# EAGLE design microBackpack (EAGLE 9.4.2)

## Sheet 1 of 2
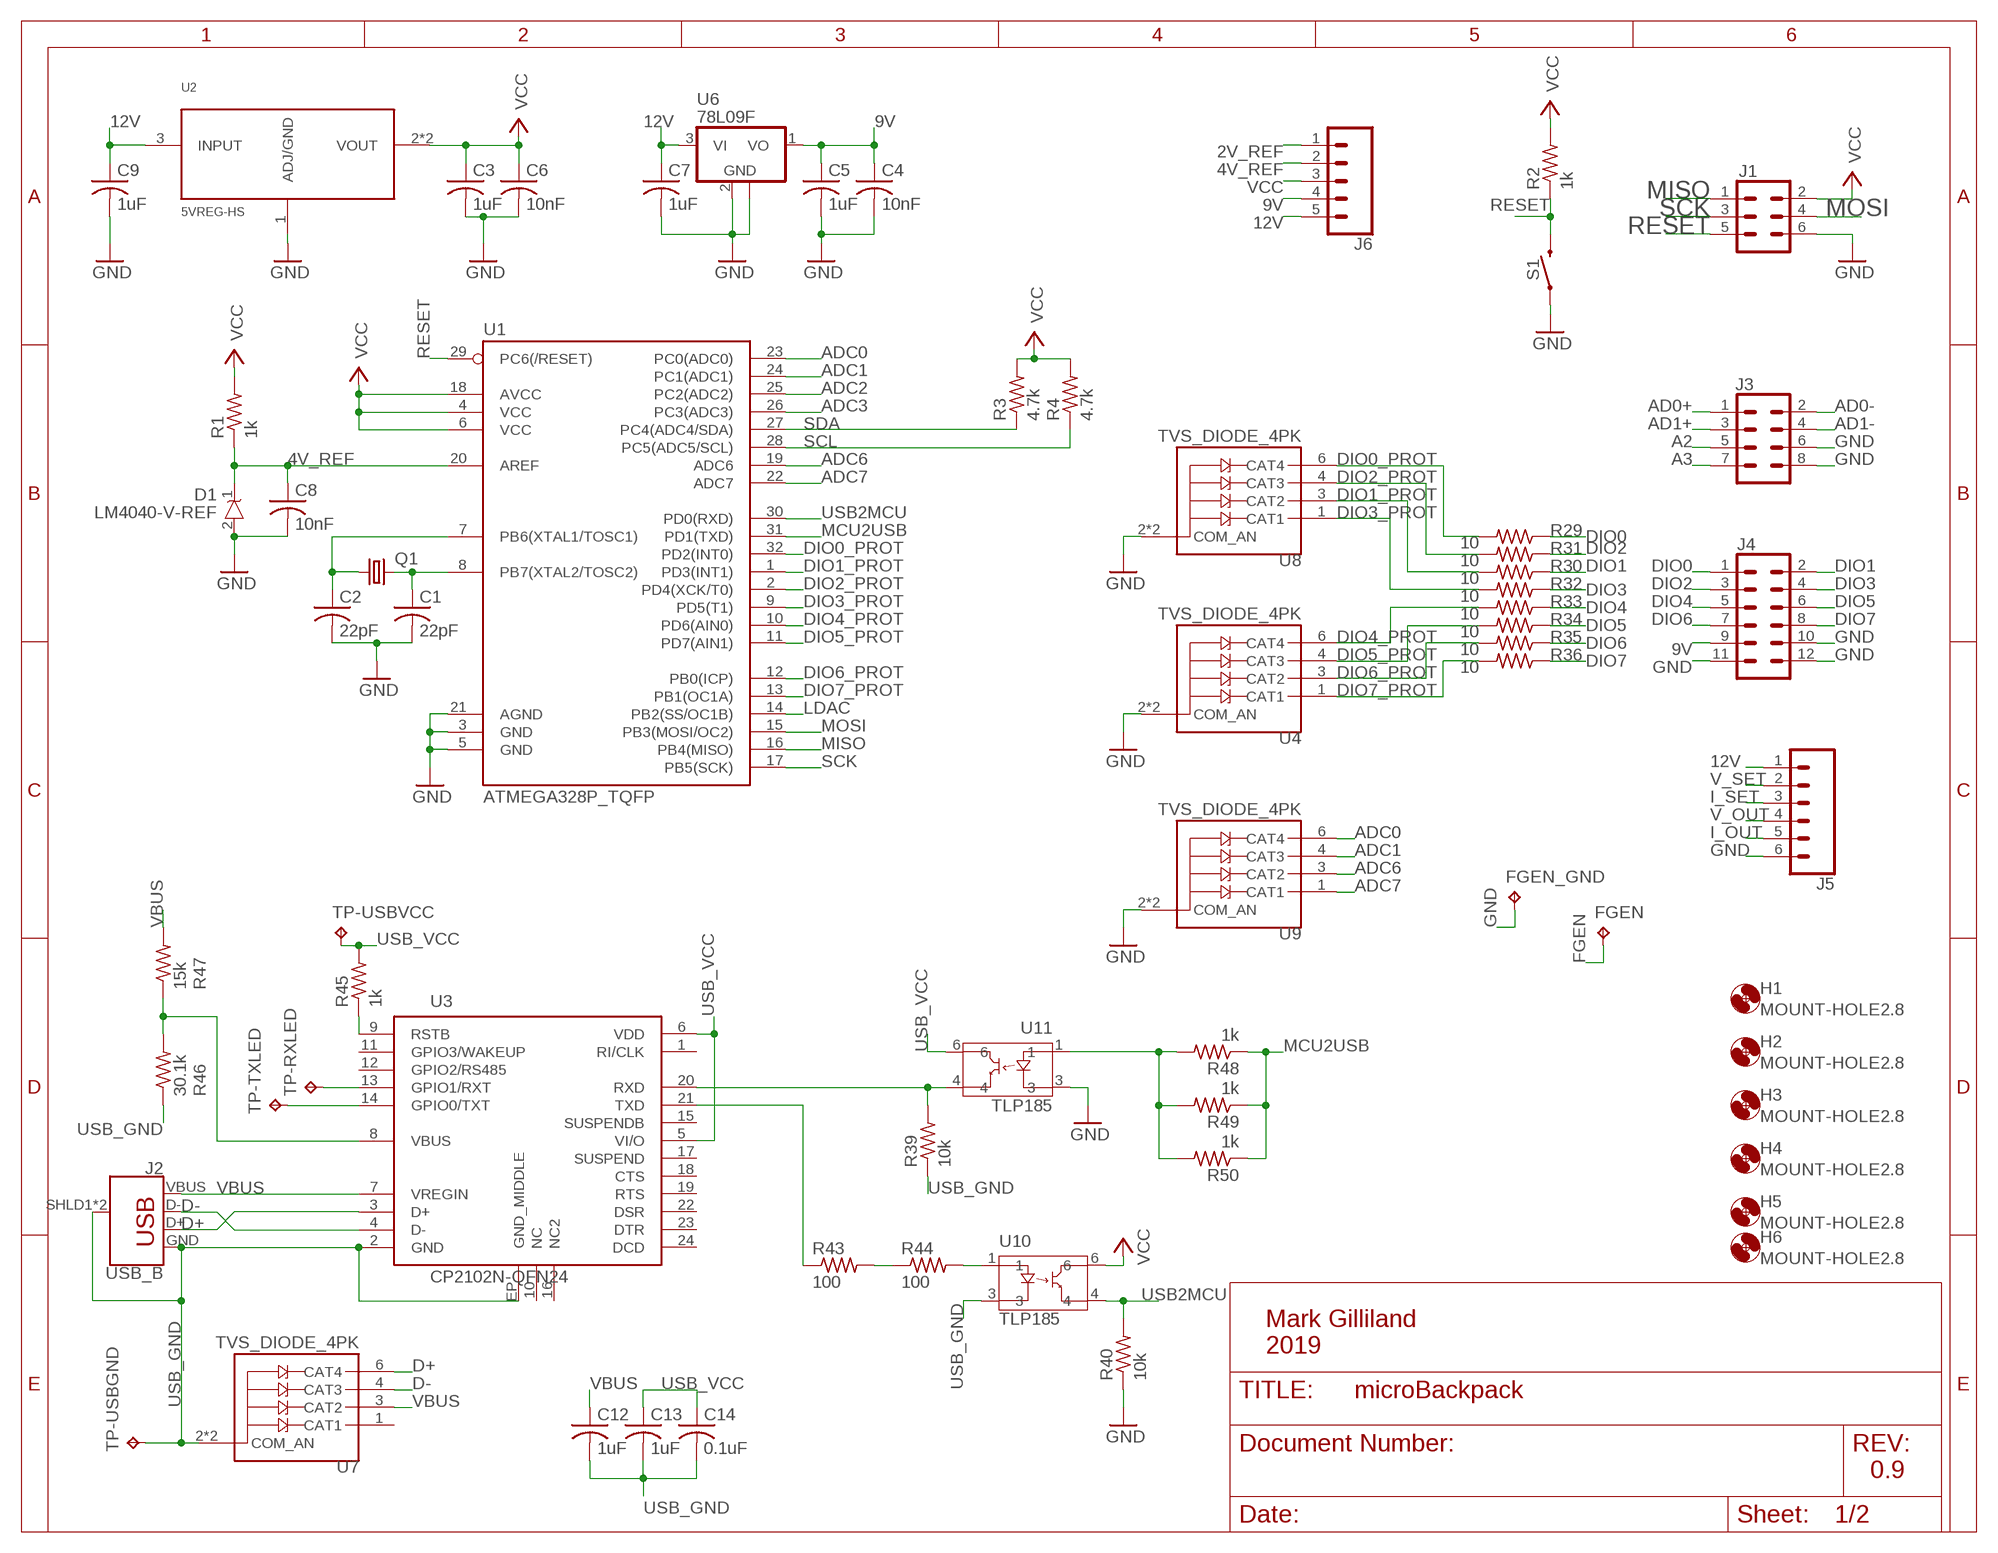
[diagram p0: schematic, sheet 1]

### Parts
C1  22pF  C-USC0805  [C0805]
C2  22pF  C-USC0805  [C0805]
C3  1uF  C-USC0805  [C0805]
C4  10nF  C-USC0805  [C0805]
C5  1uF  C-USC0805  [C0805]
C6  10nF  C-USC0805  [C0805]
C7  1uF  C-USC0805  [C0805]
C8  10nF  C-USC0805  [C0805]
C9  1uF  C-USC0805  [C0805]
C12  1uF  C-USC0805  [C0805]
C13  1uF  C-USC0805  [C0805]
C14  0.1uF  C-USC0805  [C0805]
D1  LM4040-V-REF  [SOT23]
FGEN  TPPAD1-20Y  [P1-20Y]
FGEN_GND  TPPAD1-20Y  [P1-20Y]
H1  MOUNT-HOLE2.8  [2,8]
H2  MOUNT-HOLE2.8  [2,8]
H3  MOUNT-HOLE2.8  [2,8]
H4  MOUNT-HOLE2.8  [2,8]
H5  MOUNT-HOLE2.8  [2,8]
H6  MOUNT-HOLE2.8  [2,8]
J1  CONN_03X22X3_SILK_MALE_PTH  [2X3]
J2  USB_B  [USB-B-PTH-VERT]
J3  CONN_04X2  [2X4]
J4  2X6 FEMALE  CONN_06X2PTH_FEMALE  [2X6]
J5  CONN_06SILK_FEMALE_PTH  [1X06]
J6  CONN_05NO_SILK  [1X05_NO_SILK]
Q1  CRYSTALHC49U70  [HC49U70]
R1  1k  R-US_R0805  [R0805]
R2  1k  R-US_R0805  [R0805]
R3  4.7k  R-US_R0805  [R0805]
R4  4.7k  R-US_R0805  [R0805]
R29  10  R-US_R0805  [R0805]
R30  10  R-US_R0805  [R0805]
R31  10  R-US_R0805  [R0805]
R32  10  R-US_R0805  [R0805]
R33  10  R-US_R0805  [R0805]
R34  10  R-US_R0805  [R0805]
R35  10  R-US_R0805  [R0805]
R36  10  R-US_R0805  [R0805]
R39  10k  R-US_R0805  [R0805]
R40  10k  R-US_R0805  [R0805]
R43  100  R-US_R0603  [R0603]
R44  100  R-US_R0603  [R0603]
R45  1k  R-US_R0805  [R0805]
R46  30.1k  R-US_R0805  [R0805]
R47  15k  R-US_R0805  [R0805]
R48  1k  R-US_R0805  [R0805]
R49  1k  R-US_R0805  [R0805]
R50  1k  R-US_R0805  [R0805]
S1  MOMENTARY-SWITCH-SPST-SMD-5.2-REDUNDANT  [TACTILE_SWITCH_SMD_5.2MM]
TP-RXLED  TPPAD1-13  [P1-13]
TP-TXLED  TPPAD1-13  [P1-13]
TP-USBGND  TPPAD1-13  [P1-13]
TP-USBVCC  TPPAD1-13  [P1-13]
U1  ATMEGA328P_TQFP  [TQFP32-08]
U2  5VREG-HS  [SOT223-HS]
U3  CP2102N-QFN24  [QFN-24_ALT2]
U4  TVS_DIODE_4PK  [SOT457]
U6  78L09F  [SOT89]
U7  TVS_DIODE_4PK  [SOT457]
U8  TVS_DIODE_4PK  [SOT457]
U9  TVS_DIODE_4PK  [SOT457]
U10  TLP185  [SO06-4]
U11  TLP185  [SO06-4]

### Nets
2V_REF: J6.1 ; also sheet 2
4V_REF: C8.1 D1.1(+IN) J6.2 R1.1 U1.20(AREF) ; also sheet 2
9V: C4.1 C5.1 J4.9 J6.4 U6.1(VO) ; also sheet 2
12V: C7.1 C9.1 J5.1 J6.5 U2.3(INPUT) U6.3(VI) ; also sheet 2
A2: J3.5 ; also sheet 2
A3: J3.7 ; also sheet 2
AD0+: J3.1 ; also sheet 2
AD0-: J3.2 ; also sheet 2
AD1+: J3.3 ; also sheet 2
AD1-: J3.4 ; also sheet 2
ADC0: U1.23(PC0(ADC0)) U9.6(CAT4) ; also sheet 2
ADC1: U1.24(PC1(ADC1)) U9.4(CAT3) ; also sheet 2
ADC2: U1.25(PC2(ADC2)) ; also sheet 2
ADC3: U1.26(PC3(ADC3)) ; also sheet 2
ADC6: U1.19(ADC6) U9.3(CAT2) ; also sheet 2
ADC7: U1.22(ADC7) U9.1(CAT1) ; also sheet 2
CRYS_N [crystalDiff]: C2.1 Q1.1 U1.7(PB6(XTAL1/TOSC1))
CRYS_P [crystalDiff]: C1.1 Q1.2 U1.8(PB7(XTAL2/TOSC2))
D+: J2.D+ U3.3(D+) U7.6(CAT4)
D-: J2.D- U3.4(D-) U7.4(CAT3)
DIO0: J4.1 R29.1
DIO0_PROT: R29.2 U1.32(PD2(INT0)) U8.6(CAT4)
DIO1: J4.2 R30.1
DIO1_PROT: R30.2 U1.1(PD3(INT1)) U8.3(CAT2)
DIO2: J4.3 R31.1
DIO2_PROT: R31.2 U1.2(PD4(XCK/T0)) U8.4(CAT3)
DIO3: J4.4 R32.1
DIO3_PROT: R32.2 U1.9(PD5(T1)) U8.1(CAT1)
DIO4: J4.5 R33.1
DIO4_PROT: R33.2 U1.10(PD6(AIN0)) U4.6(CAT4)
DIO5: J4.6 R34.1
DIO5_PROT: R34.2 U1.11(PD7(AIN1)) U4.4(CAT3)
DIO6: J4.7 R35.1
DIO6_PROT: R35.2 U1.12(PB0(ICP)) U4.3(CAT2)
DIO7: J4.8 R36.1
DIO7_PROT: R36.2 U1.13(PB1(OC1A)) U4.1(CAT1) ; also sheet 2
FGEN: FGEN.TP ; also sheet 2
GND: C1.2 C2.2 C3.2 C4.2 C5.2 C6.2 C7.2 C8.2 C9.2 D1.2(-IN) FGEN_GND.TP J1.6 J3.6 J3.8 J4.10 J4.11 J4.12 J5.6 R40.1 S1.1 S1.2 U1.3(GND) U1.5(GND) U1.21(AGND) U2.1(ADJ/GND) U4.2(COM_AN) U4.5(COM_AN) U6.2(GND) U6.2@1(GND) U8.2(COM_AN) U8.5(COM_AN) U9.2(COM_AN) U9.5(COM_AN) U11.3 ; also sheet 2
I_OUT: J5.5 ; also sheet 2
I_SET: J5.3 ; also sheet 2
LDAC: U1.14(PB2(SS/OC1B)) ; also sheet 2
MCU2USB: R48.1 R49.1 R50.1 U1.31(PD1(TXD))
MISO: J1.1 U1.16(PB4(MISO))
MOSI: J1.4 U1.15(PB3(MOSI/OC2))
N$5: R48.2 R49.2 R50.2 U11.1
N$7: R46.2 R47.1 U3.8(VBUS)
N$8: R44.2 U10.1
N$16: R39.2 U3.20(RXD) U11.4
N$17: R43.2 R44.1
N$20: R43.1 U3.21(TXD)
N$21: TP-RXLED.TP U3.13(GPIO1/RXT)
N$22: TP-TXLED.TP U3.14(GPIO0/TXT)
N$23: R45.1 U3.9(RSTB)
RESET: J1.5 R2.1 S1.3 S1.4 U1.29(PC6(/RESET))
SCK: J1.3 U1.17(PB5(SCK))
SCL: R4.1 U1.28(PC5(ADC5/SCL)) ; also sheet 2
SDA: R3.1 U1.27(PC4(ADC4/SDA)) ; also sheet 2
USB2MCU: R40.2 U1.30(PD0(RXD)) U10.4
USB_GND: C12.2 C13.2 C14.2 J2.GND J2.SHLD1(SHIELD) J2.SHLD2(SHIELD) R39.1 R46.1 TP-USBGND.TP U3.2(GND) U3.EP(GND_MIDDLE) U7.2(COM_AN) U7.5(COM_AN) U10.3
USB_VCC: C13.1 C14.1 R45.2 TP-USBVCC.TP U3.5(VI/O) U3.6(VDD) U11.6
V_OUT: J5.4 ; also sheet 2
V_SET: J5.2 ; also sheet 2
VBUS: C12.1 J2.VBUS R47.2 U3.7(VREGIN) U7.3(CAT2)
VCC: C3.1 C6.1 J1.2 J6.3 R1.2 R2.2 R3.2 R4.2 U1.4(VCC) U1.6(VCC) U1.18(AVCC) U2.2(VOUT) U2.4(VOUT) U10.6 ; also sheet 2
Unconnected: U3.1(RI/CLK) U3.10(NC) U3.11(GPIO3/WAKEUP) U3.12(GPIO2/RS485) U3.15(SUSPENDB) U3.16(NC2) U3.17(SUSPEND) U3.18(CTS) U3.19(RTS) U3.22(DSR) U3.23(DTR) U3.24(DCD) U7.1(CAT1)

### Notes on the sheet
- Mark Gilliland
  2019
- 0.9

## Sheet 2 of 2
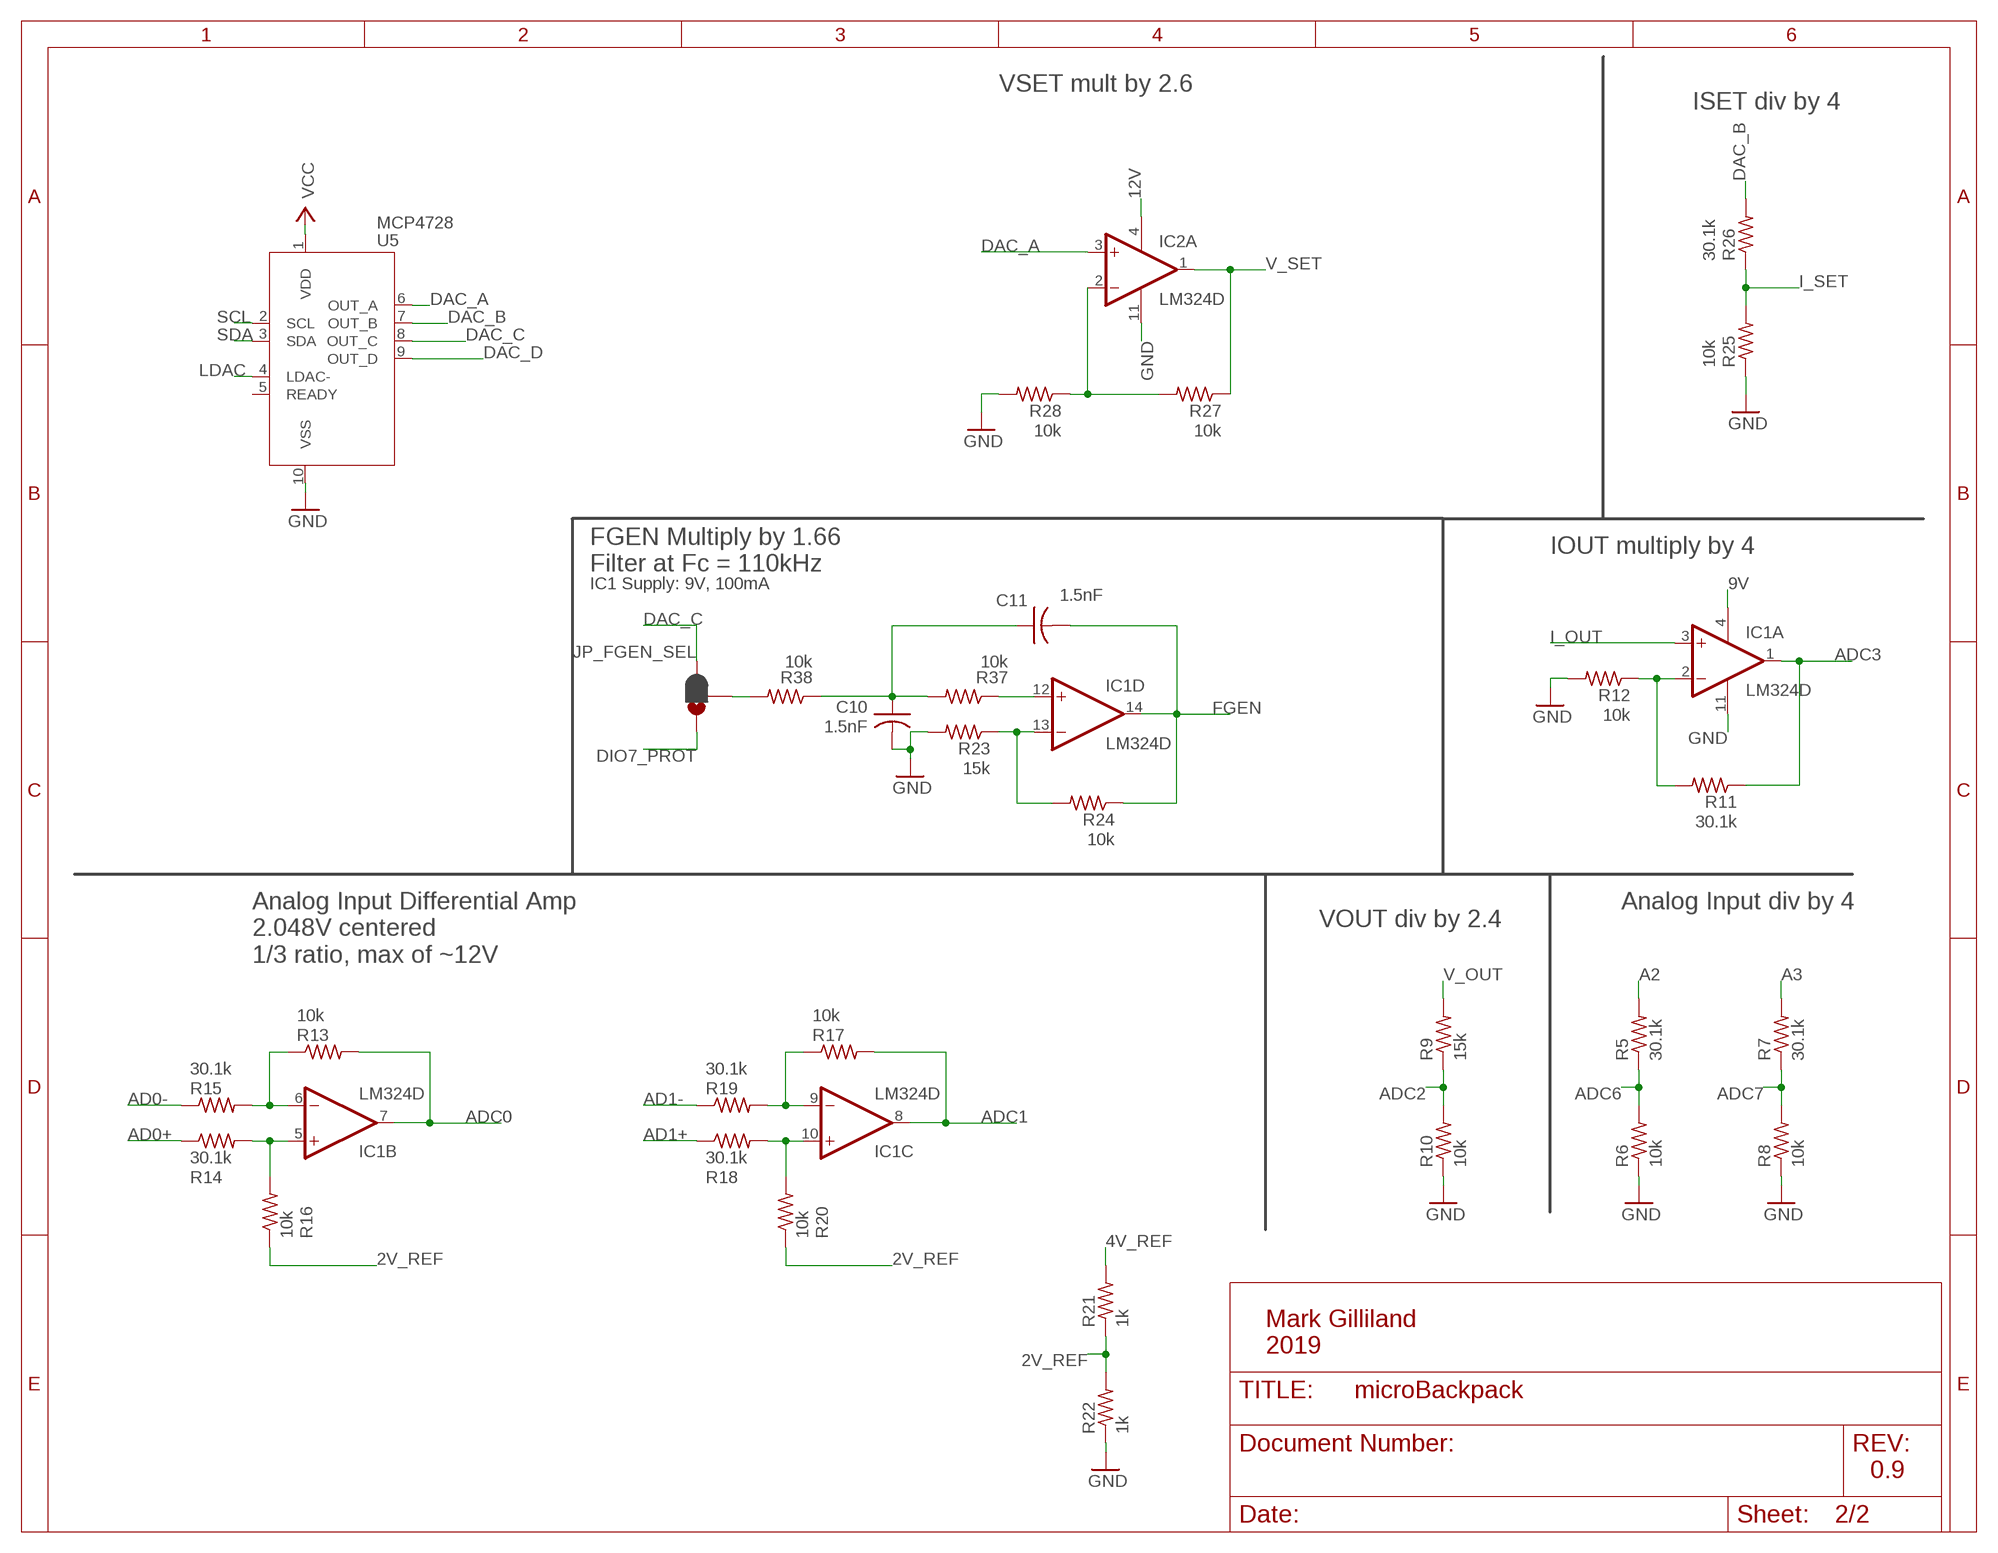
[diagram p1: schematic, sheet 2]

### Parts
C10  1.5nF  C-USC0805  [C0805]
C11  1.5nF  C-USC0805  [C0805]
IC1  LM324D  [SO14]
IC2  LM324D  [SO14]
JP_FGEN_SEL  JUMPER-SMT_3_1-NC_PASTE_SILK  [SMT-JUMPER_3_1-NC_PASTE_SILK]
R5  30.1k  R-US_R0805  [R0805]
R6  10k  R-US_R0805  [R0805]
R7  30.1k  R-US_R0805  [R0805]
R8  10k  R-US_R0805  [R0805]
R9  15k  R-US_R0805  [R0805]
R10  10k  R-US_R0805  [R0805]
R11  30.1k  R-US_R0805  [R0805]
R12  10k  R-US_R0805  [R0805]
R13  10k  R-US_R0805  [R0805]
R14  30.1k  R-US_R0805  [R0805]
R15  30.1k  R-US_R0805  [R0805]
R16  10k  R-US_R0805  [R0805]
R17  10k  R-US_R0805  [R0805]
R18  30.1k  R-US_R0805  [R0805]
R19  30.1k  R-US_R0805  [R0805]
R20  10k  R-US_R0805  [R0805]
R21  1k  R-US_R0805  [R0805]
R22  1k  R-US_R0805  [R0805]
R23  15k  R-US_R0805  [R0805]
R24  10k  R-US_R0805  [R0805]
R25  10k  R-US_R0805  [R0805]
R26  30.1k  R-US_R0805  [R0805]
R27  10k  R-US_R0805  [R0805]
R28  10k  R-US_R0805  [R0805]
R37  10k  R-US_R0805  [R0805]
R38  10k  R-US_R0805  [R0805]
U5  MCP4728  [MSOP10]

### Nets
2V_REF: R16.1 R20.1 R21.1 R22.2 ; also sheet 1
4V_REF: R21.2 ; also sheet 1
9V: IC1.4(P:V+) ; also sheet 1
12V: IC2.4(P:V+) ; also sheet 1
A2: R5.2 ; also sheet 1
A3: R7.2 ; also sheet 1
AD0+: R14.1 ; also sheet 1
AD0-: R15.1 ; also sheet 1
AD1+: R18.1 ; also sheet 1
AD1-: R19.1 ; also sheet 1
ADC0: IC1.7(B:OUT) R13.2 ; also sheet 1
ADC1: IC1.8(C:OUT) R17.2 ; also sheet 1
ADC2: R9.1 R10.2 ; also sheet 1
ADC3: IC1.1(A:OUT) R11.1 ; also sheet 1
ADC6: R5.1 R6.2 ; also sheet 1
ADC7: R7.1 R8.2 ; also sheet 1
DAC_A: IC2.3(A:+IN) U5.6(OUT_A)
DAC_B: R26.2 U5.7(OUT_B)
DAC_C: JP_FGEN_SEL.3 U5.8(OUT_C)
DAC_D: U5.9(OUT_D)
DIO7_PROT: JP_FGEN_SEL.1 ; also sheet 1
FGEN: C11.2 IC1.14(D:OUT) R24.1 ; also sheet 1
GND: C10.2 IC1.11(P:V-) IC2.11(P:V-) R6.1 R8.1 R10.1 R12.2 R22.1 R23.2 R25.1 R28.2 U5.10(VSS) ; also sheet 1
I_OUT: IC1.3(A:+IN) ; also sheet 1
I_SET: R25.2 R26.1 ; also sheet 1
LDAC: U5.4(LDAC-) ; also sheet 1
N$2: JP_FGEN_SEL.2 R38.2
N$3: IC1.13(D:-IN) R23.1 R24.2
N$4: C10.1 C11.1 R37.2 R38.1
N$6: IC1.2(A:-IN) R11.2 R12.1
N$9: IC1.6(B:-IN) R13.1 R15.2
N$10: IC1.5(B:+IN) R14.2 R16.2
N$11: IC2.2(A:-IN) R27.2 R28.1
N$12: IC1.12(D:+IN) R37.1
N$14: IC1.9(C:-IN) R17.1 R19.2
N$15: IC1.10(C:+IN) R18.2 R20.2
SCL: U5.2(SCL) ; also sheet 1
SDA: U5.3(SDA) ; also sheet 1
V_OUT: R9.2 ; also sheet 1
V_SET: IC2.1(A:OUT) R27.1 ; also sheet 1
VCC: U5.1(VDD) ; also sheet 1
Unconnected: IC2.5(B:+IN) IC2.6(B:-IN) IC2.7(B:OUT) IC2.8(C:OUT) IC2.9(C:-IN) IC2.10(C:+IN) IC2.12(D:+IN) IC2.13(D:-IN) IC2.14(D:OUT) U5.5(READY)

### Notes on the sheet
- VSET mult by 2.6
- ISET div by 4
- IOUT multiply by 4
- FGEN Multiply by 1.66
  Filter at Fc = 110kHz
- IC1 Supply: 9V, 100mA
- Analog Input div by 4
- VOUT div by 2.4
- Analog Input Differential Amp
  2.048V centered
  1/3 ratio, max of ~12V
- Mark Gilliland
  2019
- 0.9

## Library data of the parts
C1-C14 = rcl:C-US: CAPACITOR, American symbol; SPICEPREFIX: C
D1 = microBackpackLib:LM4040-V-REF: LM4040DYM3-4.1-TR from Microchip, 4.096V vref diode
FGEN FGEN_GND TP-RXLED TP-TXLED TP-USBGND TP-USBVCC = testpad:TP: Test pad
H1-H6 = holes:MOUNT-HOLE: MOUNTING HOLE with drill center marker
IC1 IC2 = linear:LM324: OP AMP
J1 = SparkFun-Connectors:CONN_03X2: Multi connection point. Often used as Generic Header-pin footprint for 0.1 inch spaced/style header connections You can populate with any combo of single row headers, but if you'd like an exact match, check these: Header - 2x3 (Male, 0.1") <https://www.sparkfun.com/products/12807> (PRT-12807) Header - 2x3 (Female, 0.1") <https://www.sparkfun.com/products/13010> (PRT-13010) 2x3 Pin Shrouded Header <https://www.sparkfun.com/products/10877> (PRT-10877) On any of the 0.1 inch spaced packages, you can populate with these: Break Away Headers - Straight <https://www.sparkfun.com/products/116> (PRT-00116) Break Away Male Headers - Right Angle <https://www.sparkfun.com/products/553> (PRT-00553) Female Headers <https://www.sparkfun.com/products/115> (PRT-00115) Break Away Headers - Machine Pin <https://www.sparkfun.com/products/117> (PRT-00117) Break Away Female Headers - Swiss Machine Pin <https://www.sparkfun.com/products/743> (PRT-00743) Special note: the shrouded connector mates well with our 3x2 ribbon cables: Ribbon Crimp Connector - 6-pin (2x3, Female) <https://www.sparkfun.com/products/10651> (PRT-10651) Ribbon Cable - 6 wire (15ft) <https://www.sparkfun.com/products/10646> (PRT-10646); PROD_ID: CONN-09701
J2 = microBackpackLib:USB_B: USB Type B Connector SparkFun Products: SparkFun Stepoko <https://www.sparkfun.com/products/13899> PTH
J3 = SparkFun-Connectors:CONN_04X2: Multi connection point. Often used as Generic Header-pin footprint for 0.1 inch spaced/style header connections On any of the 0.1 inch spaced packages, you can populate with these: Break Away Headers - Straight <https://www.sparkfun.com/products/116> (PRT-00116) Break Away Male Headers - Right Angle <https://www.sparkfun.com/products/553> (PRT-00553) Female Headers <https://www.sparkfun.com/products/115> (PRT-00115) Break Away Headers - Machine Pin <https://www.sparkfun.com/products/117> (PRT-00117) Break Away Female Headers - Swiss Machine Pin <https://www.sparkfun.com/products/743> (PRT-00743)
J4 = SparkFun-Connectors:CONN_06X2: Multi connection point. Often used as Generic Header-pin footprint for 0.1 inch spaced/style header connections On any of the 0.1 inch spaced packages, you can populate with these: Break Away Headers - Straight <https://www.sparkfun.com/products/116> (PRT-00116) Break Away Male Headers - Right Angle <https://www.sparkfun.com/products/553> (PRT-00553) Female Headers <https://www.sparkfun.com/products/115> (PRT-00115) Break Away Headers - Machine Pin <https://www.sparkfun.com/products/117> (PRT-00117) Break Away Female Headers - Swiss Machine Pin <https://www.sparkfun.com/products/743> (PRT-00743); PROD_ID: CONN-12423
J5 = SparkFun-Connectors:CONN_06: Multi connection point. Often used as Generic Header-pin footprint for 0.1 inch spaced/style header connections On any of the 0.1 inch spaced packages, you can populate with these: Break Away Headers - Straight <https://www.sparkfun.com/products/116> (PRT-00116) Break Away Male Headers - Right Angle <https://www.sparkfun.com/products/553> (PRT-00553) Female Headers <https://www.sparkfun.com/products/115> (PRT-00115) Break Away Headers - Machine Pin <https://www.sparkfun.com/products/117> (PRT-00117) Break Away Female Headers - Swiss Machine Pin <https://www.sparkfun.com/products/743> (PRT-00743) Arduino Stackable Header - 6 Pin <https://www.sparkfun.com/products/9280> (PRT-09280) For SCREWTERMINALS and SPRING TERMINALS visit here: Screw Terimnals on SparkFun.com <https://www.sparkfun.com/search/results?term=Screw+Terminals> (5mm/3.5mm/2.54mm spacing) This device is also useful as a general connection point to wire up your design to another part of your project. Our various solder wires solder well into these plated through hole pads. Hook-Up Wire - Assortment (Stranded, 22 AWG) <https://www.sparkfun.com/products/11375> (PRT-11375) Hook-Up Wire - Assortment (Solid Core, 22 AWG) <https://www.sparkfun.com/products/11367> (PRT-11367) View the entire wire category on our website here <https://www.sparkfun.com/categories/141>; PROD_ID: CONN-08437
J6 = SparkFun-Connectors:CONN_05: Multi connection point. Often used as Generic Header-pin footprint for 0.1 inch spaced/style header connections On any of the 0.1 inch spaced packages, you can populate with these: Break Away Headers - Straight <https://www.sparkfun.com/products/116> (PRT-00116) Break Away Male Headers - Right Angle <https://www.sparkfun.com/products/553> (PRT-00553) Female Headers <https://www.sparkfun.com/products/115> (PRT-00115) Break Away Headers - Machine Pin <https://www.sparkfun.com/products/117> (PRT-00117) Break Away Female Headers - Swiss Machine Pin <https://www.sparkfun.com/products/743> (PRT-00743) For SCREWTERMINALS and SPRING TERMINALS visit here: Screw Terimnals on SparkFun.com <https://www.sparkfun.com/search/results?term=Screw+Terminals> (5mm/3.5mm/2.54mm spacing) This device is also useful as a general connection point to wire up your design to another part of your project. Our various solder wires solder well into these plated through hole pads. Hook-Up Wire - Assortment (Stranded, 22 AWG) <https://www.sparkfun.com/products/11375> (PRT-11375) Hook-Up Wire - Assortment (Solid Core, 22 AWG) <https://www.sparkfun.com/products/11367> (PRT-11367) View the entire wire category on our website here <https://www.sparkfun.com/categories/141> Special notes: Molex polarized connector foot print use with SKU : PRT-08231 with associated crimp pins and housings. 1MM SMD Version SKU: PRT-10208
JP_FGEN_SEL = SparkFun-Jumpers:JUMPER-SMT_3_1-NC_PASTE: Normally closed solder jumper (1 of 2 connections) This jumper has an aperture in the stencil to allow solder paste to bridge one of the two connections. One connection is normally closed (NC), while the other is normally open (NO). Wick off the solder to open the connection. Reapply solder to reclose the connection. Apply solder to the other side instead to change the current path.
Q1 = crystal:CRYSTAL: CRYSTAL; OC_FARNELL: unknown; OC_NEWARK: unknown
R1-R40 R43-R50 = rcl:R-US_: RESISTOR, American symbol; SPICEPREFIX: R
S1 = SparkFun-Switches:MOMENTARY-SWITCH-SPST: Momentary Switch (Pushbutton) - SPST Normally-open (NO) SPST momentary switches (buttons, pushbuttons). Variants PTH-12MM - 12mm square, through-hole Momentary Pushbutton Switch - 12mm Square <https://www.sparkfun.com/products/9190> (COM-09190) PTH-6.0MM, PTH-6.0MM-KIT - 6.0mm square, through-hole Mini Pushbutton Switch <https://www.sparkfun.com/products/97> (COM-00097) KIT package intended for soldering kit's - only one side of pads' copper is exposed. PTH-RIGHT-ANGLE-KIT - Right-angle, through-hole Right Angle Tactile Button <https://www.sparkfun.com/products/10791> - Used on SparkFun BigTime Watch Kit <https://www.sparkfun.com/products/11734> SMD-12MM - 12mm square, surface-mount Tactile Button - SMD (12mm) <https://www.sparkfun.com/products/12993> (COM-12993) Used on SparkFun PicoBoard <https://www.sparkfun.com/products/11888> SMD-4.5MM - 4.5mm Square Trackball Switch Used on SparkFun Blackberry Trackballer Breakout <https://www.sparkfun.com/products/13169> SMD-4.6MMX2.8MM - 4.60mm x 2.80mm, surface mount Used on SparkFun SAMD21 Mini Breakout <https://www.sparkfun.com/products/13664> SMD-5.2MM, SMD-5.2-REDUNDANT - 5.2mm square, surface-mount Mini Pushbutton Switch - SMD <https://www.sparkfun.com/products/8720> (COM-08720) Used on Arduino Pro Mini <https://www.sparkfun.com/products/11114> REDUNDANT package connects both switch circuits together SMD-6.0X3.5MM - 6.0 x 3.5mm, surface mount Momentary Reset Switch SMD <https://www.sparkfun.com/products/8229> (COM-08229) SMD-6.2MM-TALL - 6.2mm square, surface mount Tactile Button - SMD (6mm) <https://www.sparkfun.com/products/12992> Used on SparkFun Digital Sandbox <https://www.sparkfun.com/products/12651> SMD-RIGHT-ANGLE - Right-angle, surface mount Used on SparkFun Block for Intel® Edison - Arduino <https://www.sparkfun.com/products/13036>; PROD_ID: SWCH-08247; SF_SKU: COM-08720
U1 = SparkFun-IC-Microcontroller:ATMEGA328P_TQFP: Popular 328P in QFP Storefront component: ATmega328 - TQFP <https://www.sparkfun.com/products/13448> (COM-13448) Datasheet <http://www.sparkfun.com/datasheets/Components/SMD/ATMega328.pdf> SparkFun Products SparkFun RedBoard - Programmed with Arduino <https://www.sparkfun.com/products/12757> (DEV-12757) Arduino Pro Mini 328 - 5V/16MHz <https://www.sparkfun.com/products/11113> (DEV-11113) Arduino Pro Mini 328 - 3.3V/8MHz <https://www.sparkfun.com/products/11114> (DEV-11114) SparkFun OpenLog <https://www.sparkfun.com/products/13712> (DEV-13712) SparkFun MicroView - OLED Arduino Module <https://www.sparkfun.com/products/12923> (DEV-12923) SparkFun Digital Sandbox <https://www.sparkfun.com/products/12651> (DEV-12651) SparkFun PicoBoard <https://www.sparkfun.com/products/11888> (WIG-11888) Arduino Fio <https://www.sparkfun.com/products/10116> (DEV-10116) LilyPad Arduino 328 Main Board <https://www.sparkfun.com/products/13342> (DEV-13342) SparkFun RedStick <https://www.sparkfun.com/products/13741> (DEV-13741) LilyPad MP3 <https://www.sparkfun.com/products/11013> (DEV-11013) LilyPad Arduino SimpleSnap <https://www.sparkfun.com/products/10941> (DEV-10941) SparkFun Stepoko <https://www.sparkfun.com/products/13899> (ROB-13899) SparkFun Geiger Counter <https://www.sparkfun.com/products/11345> (SEN-11345) SparkFun EL Sequencer <https://www.sparkfun.com/products/12781> (COM-12781) Arduino Pro 328 - 5V/16MHz <https://www.sparkfun.com/products/10915> (DEV-10915) CryptoCape <https://www.sparkfun.com/products/12773> (DEV-12773) SparkFun IR Thermometer Evaluation Board - MLX90614 <https://www.sparkfun.com/products/10740> (SEN-10740) SparkFun RedBot Mainboard <https://www.sparkfun.com/products/12097> (ROB-12097) Arduino Pro 328 - 3.3V/8MHz <https://www.sparkfun.com/products/10914> (DEV-10914) SparkFun Block for Intel® Edison - Arduino <https://www.sparkfun.com/products/13036> (DEV-13036) SparkFun Simon Says - Surface Mount Soldering Kit <https://www.sparkfun.com/products/10935> (KIT-10935) SparkFun 7-Segment Serial Display - Red <https://www.sparkfun.com/products/11441> (COM-11441) SparkFun 7-Segment Serial Display - White <https://www.sparkfun.com/products/11629> (COM-11629) SparkFun 7-Segment Serial Display - Yellow <https://www.sparkfun.com/products/11443> (COM-11443) SparkFun 7-Segment Serial Display - Kelly Green <https://www.sparkfun.com/products/11440> (COM-11440) SparkFun 7-Segment Serial Display - Blue <https://www.sparkfun.com/products/11442> (COM-11442) SparkFun OpenSegment Serial Display - 20mm (Blue) <https://www.sparkfun.com/products/11647> (COM-11647) SparkFun OpenSegment Serial Display - 20mm (Green) <https://www.sparkfun.com/products/11646> (COM-11646) SparkFun OpenSegment Serial Display - 20mm (White) <https://www.sparkfun.com/products/11648> (COM-11648) SparkFun OpenSegment Serial Display - 20mm (Red) <https://www.sparkfun.com/products/11644> (COM-11644) SparkFun OpenSegment Serial Display - 20mm (Yellow) <https://www.sparkfun.com/products/11645> (COM-11645) SparkFun OpenSegment Shield <https://www.sparkfun.com/products/13190> (DEV-13190); PROD_ID: IC-09069
U2 = microBackpackLib:5VREG: Diodes Inc. 800mA 3.3V cheap VREG AZ1117CH-3.3TRG1 AZ1117CH-3.3TRG1DICT-ND
U3 = microBackpackLib:CP2102N-QFN24
U4 U7-U9 = microBackpackLib:TVS_DIODE_4PK
U5 = microBackpackLib:MCP4728: MCP4728-E/UN 12-bit DAC chip on MSOP-10 package. Digital to Analog conversion, high speed
U6 = linear:78L*: POSITOIV-VOLTAGE REGULATORS Output up to 100 mA Source: Datasheet <http://focus.ti.com/lit/ds/symlink/ua78l05.pdf>
U10 U11 = microBackpackLib:TLP185

## Net classes
1 crystalDiff: width 0.254 mm

## Board
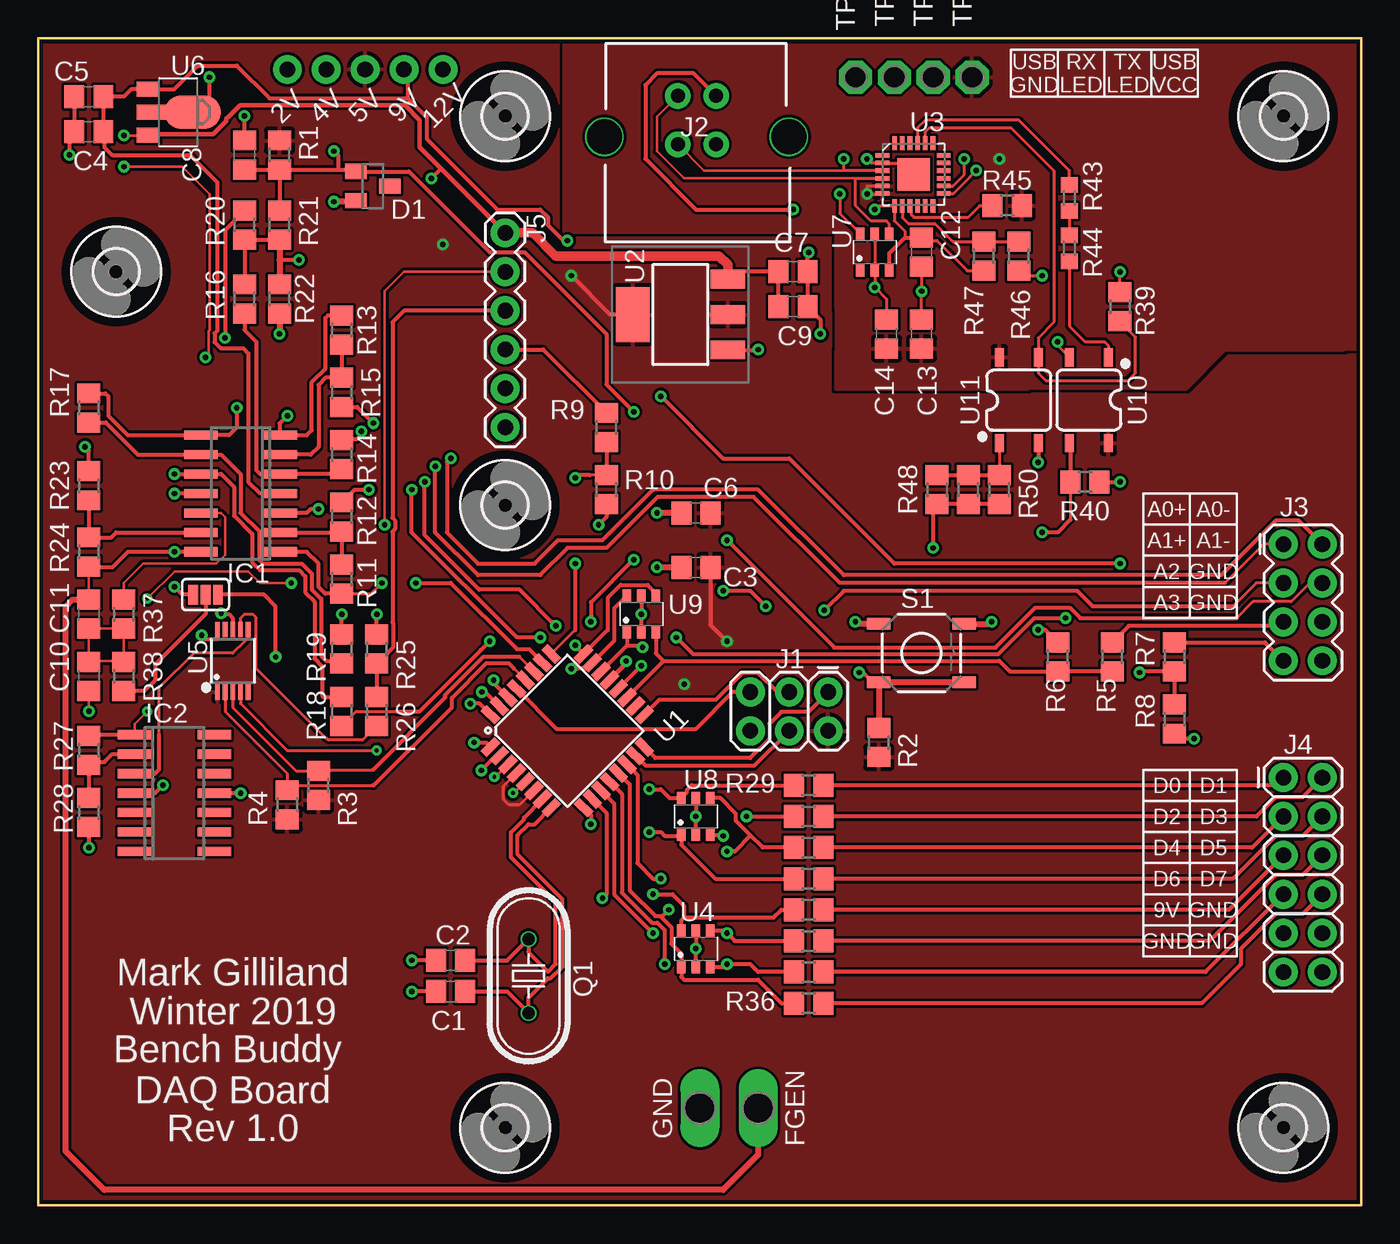
[diagram p2: board, top side]
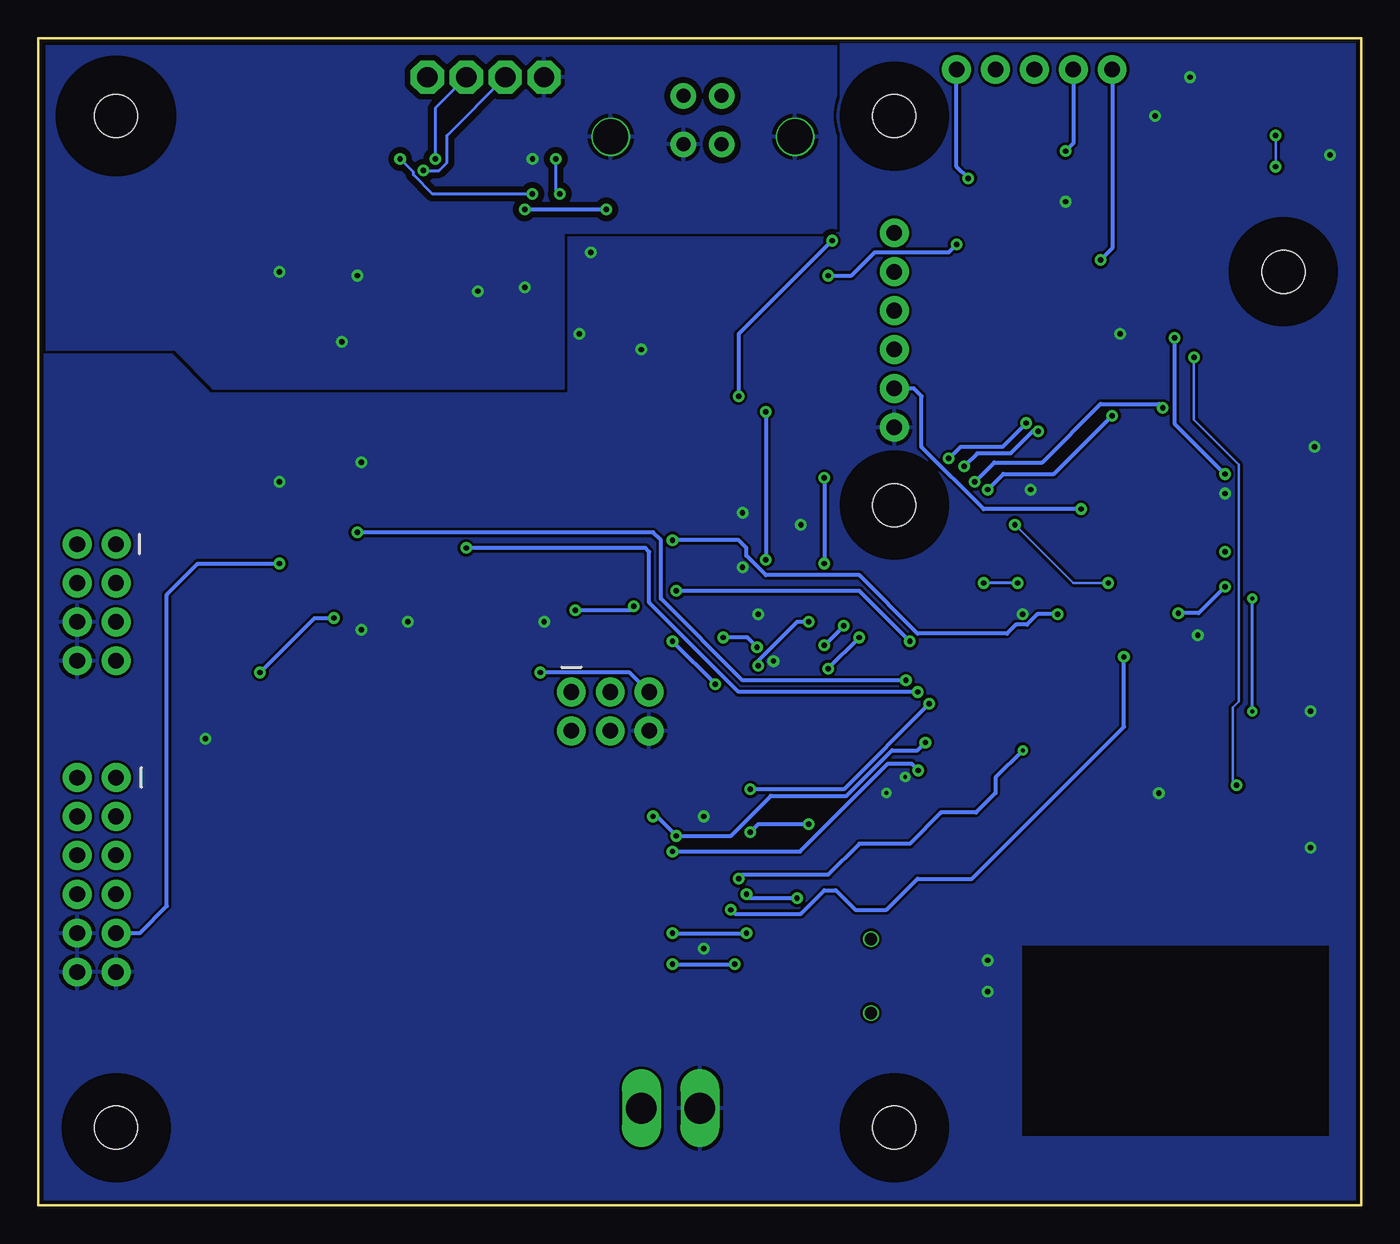
[diagram p3: board, bottom side, seen from below]

Size 86.36 x 76.2 mm. Coordinates in mm from the lower left corner, seen from the top.
Outline: 0,0 0,76.2 86.36,76.2 86.36,0 0,0
Copper layers (1*16): Top 0.0356mm / dielectric 1.5011mm / Bottom 0.0356mm
Design rules "SilverCircuits": minimum track width 7mil, minimum drill 10mil, track to track 7mil, track to pad 7mil, pad to pad 7mil, via to via 7mil, smd to smd 0mil, copper to edge 10mil, drill to drill 10mil, minimum pad ring 4mil, minimum via ring 8mil, stop-mask expansion 4mil, vias tented up to drill 0mil, thermal gap 10mil
bKeepout: area 2.1,4.6 to 22.1,4.6; area 2.1,4.6 to 22.1,4.6; area 2.1,4.6 to 22.1,4.6; area 2.1,4.6 to 22.1,4.7; area 2.1,4.7 to 22.1,4.7; area 2.1,4.7 to 22.1,4.7; area 2.1,4.7 to 22.1,4.8; area 2.1,4.8 to 22.1,4.8; area 2.1,4.8 to 22.1,4.8; area 2.1,4.8 to 22.1,4.9; area 2.1,4.9 to 22.1,4.9; area 2.1,4.9 to 22.1,4.9; 1752 more areas
bRestrict: area 2.1,4.6 to 22.1,4.6; area 2.1,4.6 to 22.1,4.6; area 2.1,4.6 to 22.1,4.6; area 2.1,4.6 to 22.1,4.7; area 2.1,4.7 to 22.1,4.7; area 2.1,4.7 to 22.1,4.7; area 2.1,4.7 to 22.1,4.8; area 2.1,4.8 to 22.1,4.8; area 2.1,4.8 to 22.1,4.8; area 2.1,4.8 to 22.1,4.9; area 2.1,4.9 to 22.1,4.9; area 2.1,4.9 to 22.1,4.9; 1752 more areas

### Footprints (pad centres in the part's own frame; a part is rotated, then mirrored left to right if it is on the bottom)
C0805 = smd 1.3 x 1.5: 1 -0.95,0; 2 0.95,0
SOT23 = smd 1 x 1.4: 1 -0.95,-1.1; 2 0.95,-1.1; 3 0,1.1
P1-20Y = drill 2.007 pad 2.54 long: TP 0,0
2,8 = hole 2.8: 0,0
SO14 = smd 0.6 x 2.2: 1 -3.81,-2.6; 2 -2.54,-2.6; 3 -1.27,-2.6; 4 0,-2.6; 5 1.27,-2.6; 6 2.54,-2.6; 7 3.81,-2.6; 8 3.81,2.6; 9 2.54,2.6; 10 1.27,2.6; 11 0,2.6; 12 -1.27,2.6; 13 -2.54,2.6; 14 -3.81,2.6
2X3 = drill 1.016 pad 1.88: 1 0,0; 2 0,2.54; 3 2.54,0; 4 2.54,2.54; 5 5.08,0; 6 5.08,2.54
USB-B-PTH-VERT = drill 0.914 pad 1.676: D+ 0.012,1.225; D- 3.175,1.225; GND 0.012,-1.275; VBUS 3.175,-1.275 | drill 2.286: SHLD1 0.508,-6.02; SHLD2 0.508,6.02
2X4 = drill 1.016 pad 1.88: 1 -3.81,-1.27; 2 -3.81,1.27; 3 -1.27,-1.27; 4 -1.27,1.27; 5 1.27,-1.27; 6 1.27,1.27; 7 3.81,-1.27; 8 3.81,1.27
2X6 = drill 1.016 pad 1.88: 1 0,0; 2 0,2.54; 3 2.54,0; 4 2.54,2.54; 5 5.08,0; 6 5.08,2.54; 7 7.62,0; 8 7.62,2.54; 9 10.16,0; 10 10.16,2.54; 11 12.7,0; 12 12.7,2.54
1X06 = drill 1.016 pad 1.88: 1 0,0; 2 2.54,0; 3 5.08,0; 4 7.62,0; 5 10.16,0; 6 12.7,0
1X05_NO_SILK = drill 1.016 pad 1.88: 1 0,0; 2 2.54,0; 3 5.08,0; 4 7.62,0; 5 10.16,0
SMT-JUMPER_3_1-NC_PASTE_SILK = smd 0.635 x 1.27: 1 -0.813,0; 2 0,0; 3 0.813,0
HC49U70 = drill 0.813: 1 -2.413,0; 2 2.413,0
R0805 = smd 1.3 x 1.5: 1 -0.95,0; 2 0.95,0
R0603 = smd 1 x 1.1: 1 -0.85,0; 2 0.85,0
TACTILE_SWITCH_SMD_5.2MM = smd 1.524 x 0.762: 1 -2.794,1.905; 2 2.794,1.905; 3 -2.794,-1.905; 4 2.794,-1.905
P1-13 = drill 1.321 pad 2.159 octagon: TP 0,0
TQFP32-08 = smd 1.27 x 0.559: 1 -4.293,2.8; 2 -4.293,2; 3 -4.293,1.2; 4 -4.293,0.4; 5 -4.293,-0.4; 6 -4.293,-1.2; 7 -4.293,-2; 8 -4.293,-2.8; 17 4.293,-2.8; 18 4.293,-2; 19 4.293,-1.2; 20 4.293,-0.4; 21 4.293,0.4; 22 4.293,1.2; 23 4.293,2; 24 4.293,2.8 | smd 0.559 x 1.27: 9 -2.8,-4.293; 10 -2,-4.293; 11 -1.2,-4.293; 12 -0.4,-4.293; 13 0.4,-4.293; 14 1.2,-4.293; 15 2,-4.293; 16 2.8,-4.293; 25 2.8,4.293; 26 2,4.293; 27 1.2,4.293; 28 0.4,4.293; 29 -0.4,4.293; 30 -1.2,4.293; 31 -2,4.293; 32 -2.8,4.293
SOT223-HS = smd 1.219 x 2.235: 1 -2.311,-3.099; 2 0,-3.099; 3 2.311,-3.099 | smd 3.6 x 2.2: 4 0,3.099
QFN-24_ALT2 = smd 0.9 x 0.3: 1 -2.05,1.25; 2 -2.05,0.75; 3 -2.05,0.25; 4 -2.05,-0.25; 5 -2.05,-0.75; 6 -2.05,-1.25; 13 1.95,-1.25; 14 1.95,-0.75; 15 1.95,-0.25; 16 1.95,0.25; 17 1.95,0.75; 18 1.95,1.25 | smd 0.3 x 0.9: 7 -1.25,-2.05; 8 -0.75,-2.05; 9 -0.25,-2.05; 10 0.25,-2.05; 11 0.75,-2.05; 12 1.25,-2.05; 19 1.25,2.05; 20 0.75,2.05; 21 0.25,2.05; 22 -0.25,2.05; 23 -0.75,2.05; 24 -1.25,2.05 | smd 2.1 x 2.1: EP 0,0
SOT457 = smd 0.55 x 0.8: 1 -0.95,-1.2; 2 0,-1.2; 3 0.95,-1.2; 4 0.95,1.2; 5 0,1.2; 6 -0.95,1.2
MSOP10 = smd 0.3 x 1: 1 -1,-2.05; 2 -0.5,-2.05; 3 0,-2.05; 4 0.5,-2.05; 5 1,-2.05; 6 1,2.05; 7 0.5,2.05; 8 0,2.05; 9 -0.5,2.05; 10 -1,2.05
SOT89 = smd 1 x 1.5: 1 -1.499,-1.981; 3 1.499,-1.981 | smd 1 x 2: 2 0,-1.727 | smd 2.2 x 3.7: 2@1 0,0.94
SO06-4 = smd 0.6 x 1.2: 1 -1.27,-2.8; 3 1.27,-2.8; 4 1.27,2.8; 6 -1.27,2.8

### Placement (x,y rotation side)
C1  26.92,13.97 180 top
C2  26.92,16 180 top
C3  42.93,41.66 180 top
C4  3.3,70.1 180 top
C5  3.3,72.39 180 top
C6  42.93,45.21 180 top
C7  49.28,60.96 0 top
C8  13.46,68.58 90 top
C9  49.28,58.67 0 top
C10  3.3,34.54 270 top
C11  3.3,38.61 90 top
C12  57.66,62.23 270 top
C13  57.66,56.9 90 top
C14  55.37,56.9 90 top
D1  21.84,66.55 270 top
FGEN  46.99,6.35 180 top
FGEN_GND  43.18,6.35 180 top
H1  5.08,60.96 0 top
H2  30.48,71.12 0 top
H3  30.48,45.72 0 top
H4  81.28,5.08 0 top
H5  81.28,71.12 0 top
H6  30.48,5.08 0 top
IC1  13.21,46.48 90 top
IC2  8.89,26.92 270 top
J1  51.56,33.53 180 top
J2  42.98,69.27 90 top
J3  82.55,39.37 270 top
J4  81.28,27.94 270 top
J5  30.48,63.5 270 top
J6  16.26,74.17 0 top
JP_FGEN_SEL  10.92,39.88 180 top
Q1  32,14.99 270 top
R1  15.75,68.58 90 top
R2  54.86,30.23 270 top
R3  18.29,27.43 270 top
R4  16.26,26.16 270 top
R5  70.1,35.81 90 top
R6  66.55,35.81 270 top
R7  74.17,35.81 90 top
R8  74.17,31.75 90 top
R9  37.08,50.8 90 top
R10  37.08,46.74 90 top
R11  19.81,40.89 90 top
R12  19.81,44.96 90 top
R13  19.81,57.15 90 top
R14  19.81,49.02 270 top
R15  19.81,53.09 90 top
R16  13.46,59.18 270 top
R17  3.3,52.07 90 top
R18  19.81,32.26 90 top
R19  19.81,36.32 270 top
R20  13.46,64.01 90 top
R21  15.75,64.01 90 top
R22  15.75,59.18 90 top
R23  3.3,46.99 90 top
R24  3.3,42.67 90 top
R25  22.1,36.32 270 top
R26  22.1,32.26 270 top
R27  3.3,29.72 270 top
R28  3.3,25.65 270 top
R29  50.29,27.43 180 top
R30  50.29,25.4 180 top
R31  50.29,23.37 180 top
R32  50.29,21.34 180 top
R33  50.29,19.3 180 top
R34  50.29,17.27 180 top
R35  50.29,15.24 180 top
R36  50.29,13.21 180 top
R37  5.59,38.61 270 top
R38  5.59,34.54 270 top
R39  70.61,58.67 270 top
R40  68.33,47.24 180 top
R43  67.31,65.79 270 top
R44  67.31,62.48 270 top
R45  63.25,65.28 0 top
R46  64.01,61.98 90 top
R47  61.72,61.98 270 top
R48  58.67,46.74 90 top
R49  60.71,46.74 90 top
R50  62.74,46.74 90 top
S1  57.66,36.07 0 top
TP-RXLED  55.88,73.66 90 top
TP-TXLED  58.42,73.66 90 top
TP-USBGND  53.34,73.66 90 top
TP-USBVCC  60.96,73.66 90 top
U1  34.54,30.99 45 top
U2  41.91,58.17 90 top
U3  57.15,67.31 0 top
U4  42.93,16.76 0 top
U5  12.7,35.56 0 top
U6  9.14,71.37 270 top
U7  54.61,62.23 0 top
U8  42.93,25.4 0 top
U9  39.37,38.61 0 top
U10  68.58,52.58 180 top
U11  64.01,52.58 0 top

### Tracks (layer width: path | path; a pad name or v marks a point on that pad's centre or on a via)
2V_REF  (via drill 0.35)
  Top 0.254: R16.1 R20.1 R21.1 | v17.02,61.72 15.75,61.72
  Top 0.406: R21.1 15.75,61.72 R22.2
  Bottom 0.254: J6.1 16.26,62.48 v17.02,61.72
4V_REF  (via drill 0.35)
  Top 0.254: 19.56,67.63 R1.1 15.75,67.56 | 19.56,67.63 20.61,67.63 D1.1 24.2,67.5 29.46,62.23 31.75,62.23 37.08,56.9 37.08,53.59 v38.86,51.82 | 15.75,67.56 R21.2 | C8.1 15.68,67.63 15.75,67.56 | U1.20 v39.37,35.25 | v38.86,42.16 36.07,39.37 v36.07,38.1 | v19.3,68.83 19.56,68.58 19.56,67.63
  Bottom 0.254: v39.37,35.25 39.37,35.56 36.83,38.1 v36.07,38.1 | v38.86,51.82 v38.86,42.16 | J6.2 18.8,69.34 v19.3,68.83
9V  (via drill 0.35)
  Top 0.254: IC1.4 14.48,46.48 13.72,47.24 13.72,55.63 13.38,55.96 11.91,55.96 11.51,56.36 11.51,56.92 11.68,57.1 11.68,66.8 9.91,68.58 4.83,68.58 4.32,69.09 4.32,70.04 C4.1 C5.1 5.59,72.39 6.07,72.87 U6.1 8.87,72.87 10.41,74.42 12.95,74.42 15.09,72.29 24.12,72.29 | 24.12,72.29 25.35,71.06 25.35,69.65 29.97,65.02 32.77,65.02 33.27,64.52 33.27,64.01 34.29,62.99 v34.54,62.99 | v40.64,52.83 44.7,48.77 49.02,48.77 55.88,41.91 v70.61,41.91 | J6.4 24.12,73.92 24.12,72.29
  Bottom 0.254: v34.54,62.99 40.64,56.9 v40.64,52.83 | J4.9 79.76,17.78 77.98,19.56 77.98,39.88 75.95,41.91 v70.61,41.91
12V  (via drill 0.35)
  Top 0.178: U6.3 7.14,69.85 v5.59,69.85 | v5.59,67.82 9.4,67.82 11.18,66.04 11.18,57.15 11.12,57.09 11.12,55.56 v10.92,55.37
  Top 0.254: IC2.4 7.62,26.92 v8.13,27.43 | C9.1 C7.1 45.49,60.96 U2.3 | v25.65,67.06 26.29,67.69
  Top 0.305: J5.1 26.29,67.69 24.89,69.09 24.89,70.87 23.93,71.83 13.17,71.83 12.46,71.12 12.45,71.12 12.26,70.94 12.26,70.78 11.43,69.94 7.23,69.94 U6.3
  Top 0.61: J5.1 32.26,63.5 33.78,61.98 44.45,61.98 45.01,61.42 U2.3
  Bottom 0.178: v5.59,69.85 v5.59,67.82 | v10.92,55.37 10.92,51.31 8,48.39 8,32.89 8.38,32.51 8.38,27.69 v8.13,27.43
  Bottom 0.254: v25.65,67.06 26.42,67.82 J6.5
A2
  Top 0.254: J3.5 81.03,37.85 71.19,37.85 R5.2
A3
  Top 0.254: R7.2 80.08,36.76 J3.7
AD0+  (via drill 0.35)
  Top 0.203: J3.1 80.01,43.18 77.47,40.64
  Top 0.254: 77.47,40.64 52.32,40.64 46.7,46.27 40.42,46.27 37.08,42.93 34.54,42.93 32.77,41.15 28.7,41.15 25.91,43.94 v25.91,48.26 | R14.1 19.88,50.04 20.83,50.04 21.08,50.29 v21.08,50.55
  Bottom 0.254: v21.08,50.55 21.44,50.55 22.89,49.1 25.07,49.1 v25.91,48.26
AD0-  (via drill 0.35)
  Top 0.254: J3.2 82.3,44.7 80.77,44.7 77.22,41.15 52.58,41.15 46.99,46.74 40.13,46.74 36.83,43.43 33.93,43.43 32.41,41.91 28.7,41.91 26.67,43.94 26.67,48.51 v26.92,48.77 | R15.1 20.81,52.14 v21.87,51.08
  Bottom 0.254: v21.87,51.08 23.42,49.53 26.16,49.53 v26.92,48.77
AD1+  (via drill 0.35)
  Top 0.203: J3.3 79.5,40.64 77.98,39.12 | R18.1 20.76,32.26 23.37,32.26
  Top 0.254: 23.37,32.26 24.89,32.26 26.14,33.5 26.14,33.51 28.9,36.27 v29.46,36.83 | 77.98,39.12 68.83,39.12 67.82,40.13 52.58,40.13 v51.31,38.86 | v47.5,39.12 46.48,40.13 v44.7,40.13
  Bottom 0.254: v29.46,36.83 32.77,40.13 v44.7,40.13 | v51.31,38.86 47.75,38.86 v47.5,39.12
AD1-  (via drill 0.35)
  Top 0.203: J3.4 83,40.64 81.78,39.42 79.3,39.42 78.23,38.35
  Top 0.254: R19.1 v19.81,38.61 | v44.96,43.43 51.97,36.42 62.48,36.42 65.1,39.04 67.34,39.04 68.02,38.35 78.23,38.35
  Bottom 0.254: v19.81,38.61 21.13,38.61 21.82,37.92 22.53,37.92 23.11,37.34 28.96,37.34 32.77,41.15 38.86,41.15 40.13,42.42 40.13,42.93 40.64,43.43 v44.96,43.43
ADC0  (via drill 0.35)
  Top 0.254: R13.2 18.91,58.1 18.76,57.95 18.76,54.65 17.86,53.75 17.86,50.62 17.53,50.29 IC1.7 15.75,50.35 15.75,51.05 v16.26,51.56 | U9.6 37.59,38.98 37.59,36.86 U1.23 35.78,35.05 35.22,35.05 | 35.22,35.05 | 35.22,35.05 v34.8,35.05 | v32.77,37.08 31.24,37.08 24.38,43.94 v24.38,46.74
  Bottom 0.254: v34.8,35.05 v32.77,37.08 | v24.38,46.74 23.37,47.75 20.07,47.75 v16.26,51.56
ADC1  (via drill 0.35)
  Top 0.254: R17.2 4.38,53.02 4.57,52.83 4.57,51.56 5.84,50.29 IC1.8 12.45,50.29 12.95,50.8 v12.95,52.07 | U9.4 40.32,39.96 39.77,40.51 38.02,40.51 37.16,39.65 37.16,37.56 U1.24 35.05,36.55 v35.05,36.58 | v33.78,37.85 31.42,40.21 28.78,40.21 25.23,43.76 v25.23,47.24
  Bottom 0.254: v35.05,36.58 v33.78,37.85 | v25.23,47.24 23.95,48.51 20.83,48.51 17.02,52.32 13.21,52.32 v12.95,52.07
ADC2  (via drill 0.35)
  Top 0.203: R10.2 36,47.69 | 35.05,37.57 U1.25
  Top 0.254: 36,47.69 35.24,47.69 v35.05,47.5 | v35.05,41.91 35.05,37.57 | R9.1 R10.2
  Bottom 0.254: v35.05,47.5 v35.05,41.91
ADC3  (via drill 0.35)
  Top 0.203: R11.1 21.73,39.94 v22.43,40.64
  Top 0.254: R11.1 18.73,39.94 18.29,40.39 18.29,41.91 17.53,42.67 IC1.1 | v24.64,40.64 26.92,40.64 31.24,36.32 32.04,36.32 U1.26
  Bottom 0.203: v22.43,40.64 v24.64,40.64
ADC6
  Top 0.254: R5.1 R6.2 63.43,34.86 62.74,35.56 40.81,35.56 | U1.19 40.81,35.56 | U9.3 40.32,36.05 40.81,35.56
ADC7  (via drill 0.35)
  Top 0.254: U1.22 38.42,36.56 38.42,36.58 | U9.1 38.42,36.58 | R8.2 R7.1 71.95,34.86 v71.88,34.8 | v67.06,38.35 65.02,38.35 62.66,35.99 42.75,35.99 v41.66,37.08 | 38.42,36.58 39.32,36.58 v39.44,36.45
  Bottom 0.254: v71.88,34.8 68.33,38.35 v67.06,38.35 | v39.44,36.45 40.08,37.08 v41.66,37.08
CRYS_N
  Top 0.254: C2.1 30.61,16 Q1.1 32,16.54 33.27,15.27 33.78,15.77 33.78,19.81 30.86,22.73 30.86,24.36 31.7,25.2 31.7,25.31 U1.7 | U1.7
CRYS_P
  Top 0.254: C1.1 30.61,13.97 Q1.2 32,13.56 33.27,14.83 33.45,14.83 34.21,15.6 34.21,19.99 31.29,22.91 31.29,24.18 32,24.89 32.41,24.89 U1.8 | U1.8
D+  (via drill 0.35)
  Top 0.178: J2.D+ 43.47,67.56 52.58,67.56
  Top 0.203: U3.3 52.58,67.56 v52.58,68.33 | v52.32,66.04 52.32,64.77 U7.6
  Bottom 0.203: v52.58,68.33 52.58,66.29 v52.32,66.04
D-
  Top 0.178: J2.D- 40.39,71.08 40.39,68.83 42.16,67.06 53.34,67.06
  Top 0.203: U3.4 53.34,67.06 53.34,65.28 54.36,64.26 55.37,64.26 55.56,64.07 U7.4
  Top 0.254: U3.4
DAC_A
  Top 0.203: U5.6 13.7,37.06 13.47,36.83 13.46,36.83 12.7,36.07 10.16,36.07 7.87,33.78 7.87,30.73
  Top 0.254: IC2.3 7.62,28.19 7.87,28.45 7.87,30.73
DAC_B
  Top 0.203: U5.7 13.2,38.35 13.46,38.61 14,38.61 14.22,38.38 14.22,35.05 18.8,30.48 18.84,30.48 18.95,30.38 21.17,30.38 R26.2
DAC_C  (via drill 0.35)
  Top 0.254: JP_FGEN_SEL.3 9.4,39.88 v8.89,40.39 | v11.94,38.67 12,38.61 12.45,38.61 12.7,38.35 U5.8
  Bottom 0.254: v8.89,40.39 10.61,38.67 v11.94,38.67
DIO0
  Top 0.254: J4.1 80.77,27.43 R29.1
DIO0_PROT  (via drill 0.35)
  Top 0.254: R29.2 42.65,27.43 42.35,27.13 42.35,26.97 U8.6 41.22,26.6 40.64,27.18 v39.88,27.18 | U1.32 28.81,32.77 v28.19,32.77
  Bottom 0.254: v28.19,32.77 33.78,27.18 v39.88,27.18
DIO1
  Top 0.254: J4.2 82.53,26.64 80.76,26.64 79.52,25.4 R30.1
DIO1_PROT  (via drill 0.35)
  Top 0.254: U8.3 44.63,24.2 v44.7,24.13 | v46.23,25.4 R30.2 | v28.45,30.23 29.23,30.23 U1.1
  Bottom 0.254: v46.23,25.4 45.97,25.4 v44.7,24.13 41.15,24.13 38.53,26.75 33.6,26.75 30.63,29.72 28.96,29.72 v28.45,30.23
DIO2
  Top 0.254: R31.1 79.25,23.37 J4.3
DIO2_PROT  (via drill 0.35)
  Top 0.254: R31.2 47.29,23.37 46.51,24.16 | 46.51,24.16 45.55,25.12 45.55,25.57 44.52,26.6 U8.4 | 46.51,24.16 45.47,23.11 v44.96,23.11 | v28.91,28.41 29.88,29.37 U1.2
  Bottom 0.254: v44.96,23.11 36.62,23.11 30.89,28.85 29.36,28.85 v28.91,28.41
DIO3
  Top 0.254: J4.4 82.55,24.13 80.77,24.13 77.98,21.34 R32.1
DIO3_PROT  (via drill 0.35)
  Top 0.254: R32.2 44.2,21.34 41.98,23.56 U8.1 41.91,24.13 40.89,24.13 40.64,24.38 v39.88,24.38 | U1.9 36.07,25.5 v36.07,24.89
  Bottom 0.254: v36.07,24.89 39.37,24.89 v39.88,24.38
DIO4
  Top 0.254: R33.1 77.72,19.3 J4.5
DIO4_PROT  (via drill 0.35)
  Top 0.254: U4.6 41.98,18.61 42.16,18.8 | R33.2 48.51,19.3 48.01,18.8 42.16,18.8 | U1.10 37.08,25.62 37.08,20.32 v36.83,20.07 | v40.13,20.32 41.4,20.32 42.16,19.56 42.16,18.8
  Bottom 0.254: v36.83,20.07 39.88,20.07 v40.13,20.32
DIO5
  Top 0.254: J4.6 82.55,21.59 80.77,21.59 77.09,17.91 76.96,17.78 76.45,17.27 R34.1
DIO5_PROT  (via drill 0.35)
  Top 0.254: U4.4 44.77,17.96 v44.96,17.78 45.47,17.27 R34.2 | U1.11 37.59,26.24 37.59,20.32 v40.13,17.78
  Bottom 0.254: v44.96,17.78 v40.13,17.78
DIO6
  Top 0.254: R35.1 76.2,15.24 J4.7
DIO6_PROT  (via drill 0.35)
  Top 0.254: U4.3 44.77,15.56 v44.96,15.75 46.48,15.75 46.99,15.24 R35.2 | U1.12 38.1,26.87 38.1,20.42 40.06,18.46 40.41,18.46 40.89,17.98 v40.89,15.75
  Bottom 0.254: v44.96,15.75 v40.89,15.75
DIO7
  Top 0.254: J4.8 82.55,19.05 80.79,19.05 78.49,16.75 78.49,15.75 75.95,13.21 R36.1
DIO7_PROT  (via drill 0.35)
  Top 0.254: R36.2 48.51,13.21 46.99,14.73 42.16,14.73 41.98,14.92 U4.1 41.98,16.44 41.33,17.09 41.33,18.16 40.59,18.89 | U1.13 38.61,27.49 38.61,20.57 40.29,18.89 40.59,18.89 | 40.59,18.89 40.74,18.89 v41.15,19.3 | v15.49,35.81 15.49,39.12 14.73,39.88 JP_FGEN_SEL.1
  Bottom 0.254: v41.15,19.3 40.89,19.05 36.58,19.05 35.05,20.57 34.29,20.57 33.02,19.3 30.99,19.3 28.96,21.34 25.4,21.34 15.49,31.24 v15.49,35.81
FGEN  (via drill 0.35)
  Top 0.178: R24.1 C11.2
  Top 0.254: IC1.14 v8.89,42.67 5.84,42.67 4.83,41.66 3.37,41.66 R24.1
  Top 0.406: FGEN.TP 46.99,3.3 44.7,1.02 4.32,1.02 1.78,3.56 1.78,39.12 2.22,39.56 C11.2
GND  (via drill 0.25, 0.35)
  Top 0.178: C10.2 v3.3,32.26
  Top 0.203: U1.5 31.05,26.92 v30.99,26.92 | U1.3 29.85,27.99 v29.77,27.99
  Top 0.254: IC1.11 v8.89,46.48 | R23.2 3.3,49.28 v3.05,49.53 | C8.2 v13.46,71.12 | C5.2 C4.2 2.03,69.78 v2.03,68.58 | v11.18,73.66 11.18,72.47 U6.2@1 U6.2 | IC2.11 v13.21,26.92 | R28.2 v3.3,23.37 | C2.2 v24.38,16 | C1.2 v24.38,13.97 | U4.5 v42.93,16.76 U4.2 | U8.5 v42.93,25.4 U8.2 | U9.5 v39.37,38.61 U9.2 | U2.1 46.97,55.85 v46.99,55.88 | R25.1 v22.1,38.61 | R12.2 20.64,46.74 v21.59,46.74 | R8.1 74.49,30.48 v75.44,30.48 | R6.1 65.72,37.59 v65.28,37.59 | R10.1 37.08,44.96 v36.58,44.45 | U11.3 v65.28,48.51 | R40.1 v70.61,47.24 | v51.05,56.9 51.05,57.85 C9.2 C7.2 50.23,62.16 v50.29,62.23 | v10.67,37.23 10.92,36.98 11.68,36.98 11.7,37 U5.10
  Top 0.305: U1.21 38.37,35.38 v38.37,35.55
  Top 0.406: C6.2 v40.39,45.21 | C3.2 v40.39,41.66 | S1.2 62.1,37.97 v62.23,38.1 | S1.1 53.47,37.97 v53.34,38.1 | R22.1 v15.75,56.9 | D1.2 20.68,65.53 v19.3,65.53
  pour Bottom (rank 3): 86.36,0 0,0 0,76.2 86.36,76.2
I_OUT  (via drill 0.35)
  Top 0.254: v18.29,45.47 17.78,45.47 17.53,45.21 IC1.3
  Bottom 0.254: J5.5 29.21,53.34 28.7,52.83 28.7,49.53 24.64,45.47 v18.29,45.47
I_SET
  Top 0.254: J5.3 23.88,58.42 23.11,57.66 23.11,44.91 23.29,44.73 23.29,44.17 23.11,43.99 23.11,38.09 23.15,38.05 23.15,36.43 R25.2 R26.1
LDAC  (via drill 0.25, 0.35)
  Top 0.203: U5.4 13.21,32.77 16.26,29.72 v22.1,29.72
  Top 0.254: v40.64,21.34 40.13,21.34 39.12,22.35 39.12,28.11 U1.14
  Bottom 0.254: v22.1,29.72 23.88,27.94 23.88,26.92 25.15,25.65 27.43,25.65 29.46,23.62 32.77,23.62 34.8,21.59 40.39,21.59 v40.64,21.34
MCU2USB  (via drill 0.35)
  Top 0.254: U1.31 29.18,33.53 v28.96,33.53 | v58.42,42.93 58.42,45.53 R48.1 R49.1 R50.1
  Bottom 0.254: v28.96,33.53 40.64,33.53 46.48,39.37 46.48,42.67 46.74,42.93 v58.42,42.93
MISO
  Top 0.254: J1.1 50.27,32.23 48.51,32.23 47.73,31.45 47.73,30.47 46.46,29.21 40.28,29.21 U1.16
MOSI
  Top 0.254: J1.4 46.74,28.7 39.66,28.7 U1.15
N$2
  Top 0.254: JP_FGEN_SEL.2 10.92,38.61 7.62,35.31 7.62,34.29 6.92,33.59 R38.2
N$3
  Top 0.254: R23.1 R24.2 4.76,43.62 5.08,43.94 IC1.13
N$4
  Top 0.178: 5.59,35.56 R37.2 C11.1 C10.1 3.37,35.56 5.59,35.56 | 5.59,35.56 R38.1
N$5
  Top 0.203: U11.1 R50.2
  Top 0.254: R48.2 R49.2 R50.2
N$6
  Top 0.254: IC1.2 19.75,43.94 R12.1 R11.2
N$7
  Top 0.203: U3.8 56.4,64.5 56.8,64.11 58.52,64.11 59.71,62.93 R47.1 R46.2
N$8
  Top 0.203: R44.2 67.31,57.4 68.33,56.39 69.6,56.39 69.85,56.13 U10.1
N$9
  Top 0.254: IC1.6 17.78,49.02 18.29,49.53 18.29,53.57 18.75,54.04 R15.2 R13.1
N$10
  Top 0.254: R14.2 19.49,47.75 IC1.5 14.48,47.75 14.22,48.01 14.22,56.39 13.46,57.15 R16.2
N$11
  Top 0.254: IC2.2 4.83,29.46 4.32,28.96 3.49,28.96 R27.2 R28.1
N$12
  Top 0.178: IC1.12 11.94,45.21 12.19,44.96 12.19,42.48 11.62,41.91 6.86,41.91 5.59,40.64 R37.1
N$14
  Top 0.254: R19.2 19.62,35.56 18.8,35.56 18.47,35.89 18.47,39.6 17.86,40.21 17.86,41.25 17.2,41.91 14.66,41.91 14.4,42.16 14.4,44.02 13.21,45.21 13.21,47.75 11.94,49.02 IC1.9 6.5,49.02 4.4,51.12 R17.1
N$15  (via drill 0.35)
  Top 0.254: R20.2 12.19,63.69 v12.19,56.64 | v8.89,47.75 IC1.10 11.94,47.75 12.78,46.91 12.78,45.03 13.97,43.84 13.97,41.98 14.48,41.48 17.02,41.48 17.42,41.07 17.42,40.03 18.03,39.42 18.03,35.71 18.54,35.2 18.54,33.27 18.61,33.21 R18.2
  Bottom 0.254: v12.19,56.64 12.19,51.05 v8.89,47.75
N$16
  Top 0.203: U3.20 57.91,69.37 57.91,70.1 58.17,70.36 63.5,70.36 66.29,67.56 66.29,57.66 65.28,56.64 U11.4 65.28,54.36 65.79,53.85 71.12,53.85 71.63,54.36 71.63,56.71 R39.2
N$17
  Top 0.203: R43.2 R44.1
N$20
  Top 0.203: U3.21 57.4,70.36 57.91,70.87 64.01,70.87 67.31,67.56 R43.1
N$21  (via drill 0.35)
  Top 0.203: v61.21,67.56 60.83,67.18 60.83,67.15 59.74,66.06 U3.13
  Bottom 0.203: v61.21,67.56 60.2,67.56 59.69,68.07 59.69,69.85 TP-RXLED.TP
N$22  (via drill 0.35)
  Top 0.203: U3.14 59.7,66.56 60.45,67.31 v60.45,68.33
  Bottom 0.203: TP-TXLED.TP 60.45,71.63 v60.45,68.33
N$23
  Top 0.203: U3.9 56.97,65.19 56.97,64.69 57.15,64.52 60.71,64.52 61.47,65.28 R45.1
RESET  (via drill 0.35)
  Top 0.254: U1.29 33.87,31.09 42.9,31.09 45.33,33.53 J1.5 | v53.59,34.8 53.85,34.8 54.48,34.16 S1.3
  Top 0.406: R2.1 S1.3 S1.4
  Bottom 0.254: J1.5 47.75,34.8 v53.59,34.8
SCK
  Top 0.254: U1.17 40.54,33.02 44.21,33.02 45.97,34.77 47,34.77 48.24,33.53 J1.3
SCL
  Top 0.203: U5.2 12.2,32.25 16.26,28.19 R4.1 16.58,27.43 21.84,27.43 | 31.05,35.05 U1.28
  Top 0.254: 21.84,27.43 21.9,27.43 27,32.53 27,33.15 29.26,35.41 30.69,35.41 31.05,35.05
SDA
  Top 0.203: U5.3 12.7,32.51 16.83,28.38 R3.1 18.35,28.45 21.84,28.45 | 31.41,35.81 U1.27
  Top 0.254: 21.84,28.45 26.57,33.17 26.57,33.33 29.08,35.84 31.39,35.84 31.41,35.81
USB2MCU  (via drill 0.35)
  Top 0.203: R40.2 67.38,44.77
  Top 0.254: U1.30 29.72,34.12 v29.72,34.29 | 67.38,44.77 66.55,43.94 v65.53,43.94 | U10.4 67.38,49.71 R40.2
  Bottom 0.254: v29.72,34.29 40.39,34.29 45.72,39.62 45.72,43.43 46.23,43.94 v65.53,43.94
USB_GND  (via drill 0.35)
  Top 0.203: U7.5 U7.2 v54.61,59.94 55.37,59.18 C14.2 | C12.2 v57.66,59.69 C13.2 | v54.09,68.33 54.36,68.06 U3.2 56.63,68.06 56.64,68.07 57.15,67.56 U3.EP | R46.1 64.33,60.71 v65.53,60.71 | U10.3 66.55,56.14 v66.55,56.39 | R39.1 v70.61,60.96
  pour Bottom (isolate 0.381): 34.29,76.2 34.29,63.5 52.07,63.5 52.07,53.34 74.93,53.34 77.47,55.88 86.36,55.88 86.36,76.2
USB_VCC  (via drill 0.35)
  Top 0.203: U3.5 55.09,66.55 54.1,66.55 v54.1,66.04 55.08,66.04 U3.6
  Bottom 0.203: v62.74,68.33 61.87,67.46 61.87,67.29 60.62,66.04 v54.1,66.04
  pour Top: 34.29,76.2 34.29,63.5 52.07,63.5 52.07,53.34 74.93,53.34 77.47,55.88 86.36,55.88 86.36,76.2
  pour Top (isolate 1.016): 34.29,76.2 34.29,63.5 52.07,63.5 52.07,53.34 74.93,53.34 77.47,55.88 86.36,55.88 86.36,76.2
V_OUT
  Top 0.254: J5.4 32.95,55.88 R9.2
V_SET  (via drill 0.25, 0.35)
  Top 0.178: v16.51,40.64 14.48,40.64 13.72,41.4 8.89,41.4 v7.11,39.62 | IC2.1 6.29,31.44 v7.11,32.26 | J5.2 23.88,60.96 22.61,59.69 v22.61,44.45
  Top 0.254: IC2.1 3.37,30.73 R27.1
  Bottom 0.178: v22.61,44.45 18.8,40.64 v16.51,40.64
  Bottom 0.203: v7.11,32.26 v7.11,39.62
VBUS  (via drill 0.35)
  Top 0.203: v54.61,65.02 54.85,65.26 U3.7 55.88,65.24 55.88,64.29 56.58,63.6 56.58,63.18 | C12.1 57.85,62.99 58.67,62.99 60.64,61.03 R47.2
  Top 0.254: U7.3 55.56,62.16 56.58,63.18 C12.1 | J2.VBUS 42.78,73.91 40.39,73.91 39.62,73.15 39.62,68.33 42.93,65.02 v49.28,65.02
  Bottom 0.254: v49.28,65.02 v54.61,65.02
VCC  (via drill 0.35)
  Top 0.203: U1.6 31.41,26.16 30.73,26.16 30.38,26.52 30.38,27.39 U1.4
  Top 0.254: U2.4 37.34,58.17 v34.8,60.71 | C3.1 43.88,37.91 v44.96,36.83
  Bottom 0.254: v34.8,60.71 33.27,60.71 31.75,62.23 26.92,62.23 v26.42,62.74 | v44.96,36.83 v42.16,34.04
  pour Top (rank 2): 86.36,0 0,0 0,76.2 86.36,76.2

### Text on the board
tNames: USB / GND | RX / LED | TX / LED | USB / VCC | 2V | 4V | 5V | 9V | 12V | A0+ | A0- | A1+ | A1- | A2 | GND | A3 | GND | D0 | D1 | D2 | D3 | D4 | D5 | D6 | D7 | 9V | GND | GND | GND | Mark Gilliland | Winter 2019 | Bench Buddy / DAQ Board | GND | Rev 1.0